# EAGLE design asserv-pami (EAGLE 9.6.2)
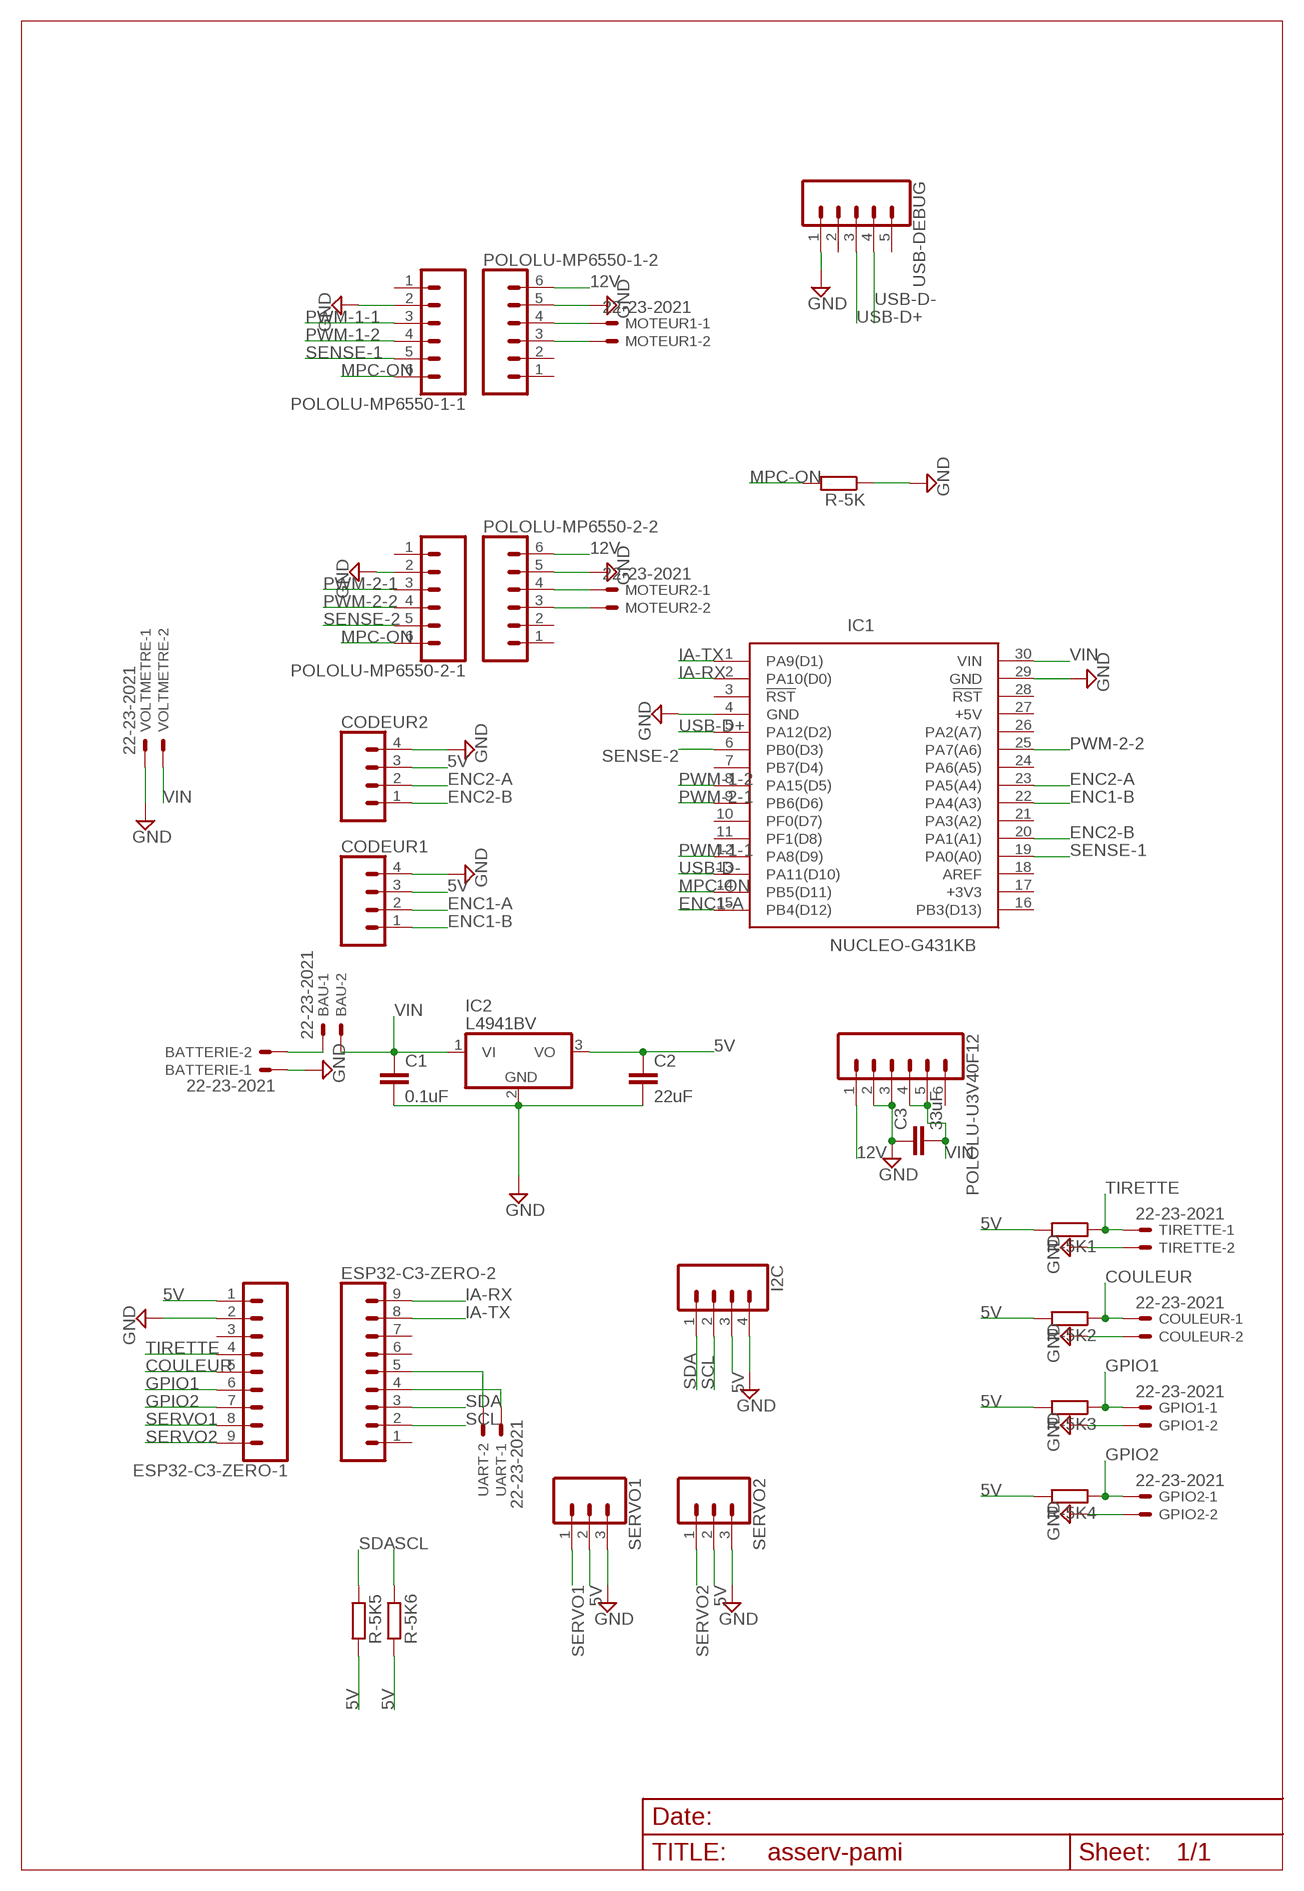
[diagram p0: schematic, sheet 1]

## Parts
BATTERIE  22-23-2021  [22-23-2021]
BAU  22-23-2021  [22-23-2021]
C1  0.1uF  C5/2.5  [C5B2.5]
C2  22uF  C5/2.5  [C5B2.5]
C3  33uF  C5/2.5  [C5B2.5]
CODEUR1  CONN_04PTH  [1X04]
CODEUR2  CONN_04PTH  [1X04]
COULEUR  22-23-2021  [22-23-2021]
ESP32-C3-ZERO-1  CONN_09LONGPADS  [1X09_LONGPADS]
ESP32-C3-ZERO-2  CONN_09LONGPADS  [1X09_LONGPADS]
GPIO1  22-23-2021  [22-23-2021]
GPIO2  22-23-2021  [22-23-2021]
I2C  CONN_04PTH  [1X04]
IC1  NUCLEO-G431KB  [DIPS1524W66P254L5029H1500Q30N]
IC2  L4941BV  7805TV  [TO220V]
MOTEUR1  22-23-2021  [22-23-2021]
MOTEUR2  22-23-2021  [22-23-2021]
POLOLU-MP6550-1-1  CONN_06NO_SILK_FEMALE_PTH  [1X06_NO_SILK]
POLOLU-MP6550-1-2  CONN_06NO_SILK_FEMALE_PTH  [1X06_NO_SILK]
POLOLU-MP6550-2-1  CONN_06NO_SILK_FEMALE_PTH  [1X06_NO_SILK]
POLOLU-MP6550-2-2  CONN_06NO_SILK_FEMALE_PTH  [1X06_NO_SILK]
POLOLU-U3V40F12  CONN_06NO_SILK_FEMALE_PTH  [1X06_NO_SILK]
R-5K  R-EU_0204/7  [0204/7]
R-5K1  R-EU_0204/7  [0204/7]
R-5K2  R-EU_0204/7  [0204/7]
R-5K3  R-EU_0204/7  [0204/7]
R-5K4  R-EU_0204/7  [0204/7]
R-5K5  R-EU_0204/7  [0204/7]
R-5K6  R-EU_0204/7  [0204/7]
SERVO1  CONN_03LONGPADS  [1X03_LONGPADS]
SERVO2  CONN_03LONGPADS  [1X03_LONGPADS]
TIRETTE  22-23-2021  [22-23-2021]
UART  22-23-2021  [22-23-2021]
USB-DEBUG  CONN_05NO_SILK  [1X05_NO_SILK]
VOLTMETRE  22-23-2021  [22-23-2021]

## Nets
5V: C2.1 CODEUR1.3 CODEUR2.3 ESP32-C3-ZERO-1.1 I2C.3 IC2.3(VO) R-5K1.2 R-5K2.2 R-5K3.2 R-5K4.2 R-5K5.2 R-5K6.2 SERVO1.2 SERVO2.2
12V: POLOLU-MP6550-1-2.6 POLOLU-MP6550-2-2.6 POLOLU-U3V40F12.1
COULEUR: COULEUR.1 ESP32-C3-ZERO-1.5 R-5K2.1
ENC1-A: CODEUR1.2 IC1.15(PB4(D12))
ENC1-B: CODEUR1.1 IC1.22(PA4(A3))
ENC2-A: CODEUR2.2 IC1.23(PA5(A4))
ENC2-B: CODEUR2.1 IC1.20(PA1(A1))
GND: BATTERIE.1 C1.2 C2.2 C3.1 CODEUR1.4 CODEUR2.4 COULEUR.2 ESP32-C3-ZERO-1.2 GPIO1.2 GPIO2.2 I2C.4 IC1.4(GND) IC1.29(GND) IC2.2(GND) POLOLU-MP6550-1-1.2 POLOLU-MP6550-1-2.5 POLOLU-MP6550-2-1.2 POLOLU-MP6550-2-2.5 POLOLU-U3V40F12.2 POLOLU-U3V40F12.3 R-5K.1 SERVO1.3 SERVO2.3 TIRETTE.2 USB-DEBUG.1 VOLTMETRE.1
GPIO1: ESP32-C3-ZERO-1.6 GPIO1.1 R-5K3.1
GPIO2: ESP32-C3-ZERO-1.7 GPIO2.1 R-5K4.1
IA-RX: ESP32-C3-ZERO-2.9 IC1.2(PA10(D0))
IA-TX: ESP32-C3-ZERO-2.8 IC1.1(PA9(D1))
MPC-ON: IC1.14(PB5(D11)) POLOLU-MP6550-1-1.6 POLOLU-MP6550-2-1.6 R-5K.2
N$1: MOTEUR1.1 POLOLU-MP6550-1-2.4
N$2: MOTEUR1.2 POLOLU-MP6550-1-2.3
N$3: MOTEUR2.1 POLOLU-MP6550-2-2.4
N$4: MOTEUR2.2 POLOLU-MP6550-2-2.3
N$5: ESP32-C3-ZERO-2.4 UART.1
N$6: ESP32-C3-ZERO-2.5 UART.2
N$7: BATTERIE.2 BAU.1
PWM-1-1: IC1.12(PA8(D9)) POLOLU-MP6550-1-1.3
PWM-1-2: IC1.8(PA15(D5)) POLOLU-MP6550-1-1.4
PWM-2-1: IC1.9(PB6(D6)) POLOLU-MP6550-2-1.3
PWM-2-2: IC1.25(PA7(A6)) POLOLU-MP6550-2-1.4
SCL: ESP32-C3-ZERO-2.2 I2C.2 R-5K6.1
SDA: ESP32-C3-ZERO-2.3 I2C.1 R-5K5.1
SENSE-1: IC1.19(PA0(A0)) POLOLU-MP6550-1-1.5
SENSE-2: IC1.6(PB0(D3)) POLOLU-MP6550-2-1.5
SERVO1: ESP32-C3-ZERO-1.8 SERVO1.1
SERVO2: ESP32-C3-ZERO-1.9 SERVO2.1
TIRETTE: ESP32-C3-ZERO-1.4 R-5K1.1 TIRETTE.1
USB-D+: IC1.5(PA12(D2)) USB-DEBUG.3
USB-D-: IC1.13(PA11(D10)) USB-DEBUG.4
VIN: BAU.2 C1.1 C3.2 IC1.30(VIN) IC2.1(VI) POLOLU-U3V40F12.4 POLOLU-U3V40F12.5 VOLTMETRE.2
Unconnected: ESP32-C3-ZERO-1.3 ESP32-C3-ZERO-2.1 ESP32-C3-ZERO-2.6 ESP32-C3-ZERO-2.7 IC1.3(!RST) IC1.7(PB7(D4)) IC1.10(PF0(D7)) IC1.11(PF1(D8)) IC1.16(PB3(D13)) IC1.17(+3V3) IC1.18(AREF) IC1.21(PA3(A2)) IC1.24(PA6(A5)) IC1.26(PA2(A7)) IC1.27(+5V) IC1.28(!RST) POLOLU-MP6550-1-1.1 POLOLU-MP6550-1-2.1 POLOLU-MP6550-1-2.2 POLOLU-MP6550-2-1.1 POLOLU-MP6550-2-2.1 POLOLU-MP6550-2-2.2 POLOLU-U3V40F12.6 USB-DEBUG.2 USB-DEBUG.5

## Library data of the parts
BATTERIE BAU COULEUR GPIO1 GPIO2 MOTEUR1 MOTEUR2 TIRETTE UART VOLTMETRE = con-molex:22-23-2021: .100" (2.54mm) Center Header - 2 Pin; MF: MOLEX; MPN: 22-23-2021; OC_FARNELL: 1462926; OC_NEWARK: 25C3832
C1-C3 = capacitor-wima:C: CAPACITOR naming: grid - package width
CODEUR1 CODEUR2 I2C = SparkFun-Connectors:CONN_04: Multi connection point. Often used as Generic Header-pin footprint for 0.1 inch spaced/style header connections On any of the 0.1 inch spaced packages, you can populate with these: Break Away Headers - Straight <https://www.sparkfun.com/products/116> (PRT-00116) Break Away Male Headers - Right Angle <https://www.sparkfun.com/products/553> (PRT-00553) Female Headers <https://www.sparkfun.com/products/115> (PRT-00115) Break Away Headers - Machine Pin <https://www.sparkfun.com/products/117> (PRT-00117) Break Away Female Headers - Swiss Machine Pin <https://www.sparkfun.com/products/743> (PRT-00743) For SCREWTERMINALS and SPRING TERMINALS visit here: Screw Terimnals on SparkFun.com <https://www.sparkfun.com/search/results?term=Screw+Terminals> (5mm/3.5mm/2.54mm spacing) This device is also useful as a general connection point to wire up your design to another part of your project. Our various solder wires solder well into these plated through hole pads. Hook-Up Wire - Assortment (Stranded, 22 AWG) <https://www.sparkfun.com/products/11375> (PRT-11375) Hook-Up Wire - Assortment (Solid Core, 22 AWG) <https://www.sparkfun.com/products/11367> (PRT-11367) View the entire wire category on our website here <https://www.sparkfun.com/categories/141> Special notes: Molex polarized connector foot print use with SKU : PRT-08231 with associated crimp pins and housings. 1MM SMD Version SKU: PRT-10208; PROD_ID: CONN-09696
ESP32-C3-ZERO-1 ESP32-C3-ZERO-2 = SparkFun-Connectors:CONN_09: Multi connection point. Often used as Generic Header-pin footprint for 0.1 inch spaced/style header connections On any of the 0.1 inch spaced packages, you can populate with these: Break Away Headers - Straight <https://www.sparkfun.com/products/116> (PRT-00116) Break Away Male Headers - Right Angle <https://www.sparkfun.com/products/553> (PRT-00553) Female Headers <https://www.sparkfun.com/products/115> (PRT-00115) Break Away Headers - Machine Pin <https://www.sparkfun.com/products/117> (PRT-00117) Break Away Female Headers - Swiss Machine Pin <https://www.sparkfun.com/products/743> (PRT-00743) For SCREWTERMINALS and SPRING TERMINALS visit here: Screw Terimnals on SparkFun.com <https://www.sparkfun.com/search/results?term=Screw+Terminals> (5mm/3.5mm/2.54mm spacing) This device is also useful as a general connection point to wire up your design to another part of your project. Our various solder wires solder well into these plated through hole pads. Hook-Up Wire - Assortment (Stranded, 22 AWG) <https://www.sparkfun.com/products/11375> (PRT-11375) Hook-Up Wire - Assortment (Solid Core, 22 AWG) <https://www.sparkfun.com/products/11367> (PRT-11367) View the entire wire category on our website here <https://www.sparkfun.com/categories/141> Special notes: Molex polarized connector foot print use with SKU : PRT-08231 with associated crimp pins and housings. 1MM SMD Version SKU: PRT-10208 NOTES ON THE VARIANTS LOCK and LOCK_LONGPADS... This footprint was designed to help hold the alignment of a through-hole component (i.e. 6-pin header) while soldering it into place. You may notice that each hole has been shifted either up or down by 0.005 of an inch from it's more standard position (which is a perfectly straight line). This slight alteration caused the pins (the squares in the middle) to touch the edges of the holes. Because they are alternating, it causes a "brace" to hold the component in place. 0.005 has proven to be the perfect amount of "off-center" position when using our standard breakaway headers. Although looks a little odd when you look at the bare footprint, once you have a header in there, the alteration is very hard to notice. Also,if you push a header all the way into place, it is covered up entirely on the bottom side.
IC1 = NUCLEO-G431KB:NUCLEO-G431KB: STM32 Nucleo-32 development board Source: Datasheet <http://www.st.com/content/ccc/resource/technical/document/data_brief/b1/d8/13/d4/b0/b7/4b/6e/DM00214578.pdf/files/DM00214578.pdf/jcr:content/translations/en.DM00214578.pdf>; ARROW_PART_NUMBER: NUCLEO-F303K8; ARROW_PRICE-STOCK: https://www.arrow.com/en/products/nucleo-f303k8/stmicroelectronics; DESCRIPTION: STM32 Nucleo-32 development board; HEIGHT: 15mm; MANUFACTURER_NAME: STMicroelectronics; MANUFACTURER_PART_NUMBER: NUCLEO-F303K8; RS_PART_NUMBER: 9092862; RS_PRICE-STOCK: http://uk.rs-online.com/web/p/products/9092862
IC2 = linear:78*: Positive VOLTAGE REGULATOR Source: http://cache.national.com/ds/LM/LM78L05.pdf http://www.fairchildsemi.com/ds/LM/LM7805.pdf
POLOLU-MP6550-1-1 POLOLU-MP6550-1-2 POLOLU-MP6550-2-1 POLOLU-MP6550-2-2 POLOLU-U3V40F12 = SparkFun-Connectors:CONN_06: Multi connection point. Often used as Generic Header-pin footprint for 0.1 inch spaced/style header connections On any of the 0.1 inch spaced packages, you can populate with these: Break Away Headers - Straight <https://www.sparkfun.com/products/116> (PRT-00116) Break Away Male Headers - Right Angle <https://www.sparkfun.com/products/553> (PRT-00553) Female Headers <https://www.sparkfun.com/products/115> (PRT-00115) Break Away Headers - Machine Pin <https://www.sparkfun.com/products/117> (PRT-00117) Break Away Female Headers - Swiss Machine Pin <https://www.sparkfun.com/products/743> (PRT-00743) Arduino Stackable Header - 6 Pin <https://www.sparkfun.com/products/9280> (PRT-09280) Screw Terminals 2.54mm Pitch (6-Pin) <https://www.sparkfun.com/products/16499> (PRT-16499) For SCREWTERMINALS and SPRING TERMINALS visit here: Screw Terimnals on SparkFun.com <https://www.sparkfun.com/search/results?term=Screw+Terminals> (5mm/3.5mm/2.54mm spacing) This device is also useful as a general connection point to wire up your design to another part of your project. Our various solder wires solder well into these plated through hole pads. Hook-Up Wire - Assortment (Stranded, 22 AWG) <https://www.sparkfun.com/products/11375> (PRT-11375) Hook-Up Wire - Assortment (Solid Core, 22 AWG) <https://www.sparkfun.com/products/11367> (PRT-11367) View the entire wire category on our website here <https://www.sparkfun.com/categories/141>; PROD_ID: CONN-08437
R-5K R-5K1-R-5K6 = rcl:R-EU_: RESISTOR, European symbol; SPICEPREFIX: R
SERVO1 SERVO2 = SparkFun-Connectors:CONN_03: Multi connection point. Often used as Generic Header-pin footprint for 0.1 inch spaced/style header connections On any of the 0.1 inch spaced packages, you can populate with these: Break Away Headers - Straight <https://www.sparkfun.com/products/116> (PRT-00116) Break Away Male Headers - Right Angle <https://www.sparkfun.com/products/553> (PRT-00553) Female Headers <https://www.sparkfun.com/products/115> (PRT-00115) Break Away Headers - Machine Pin <https://www.sparkfun.com/products/117> (PRT-00117) Break Away Female Headers - Swiss Machine Pin <https://www.sparkfun.com/products/743> (PRT-00743) Stackable Header - 3 Pin (Female, 0.1") <https://www.sparkfun.com/products/13875> (PRT-13875) For SCREWTERMINALS and SPRING TERMINALS visit here: Screw Terimnals on SparkFun.com <https://www.sparkfun.com/search/results?term=Screw+Terminals> (5mm/3.5mm/2.54mm spacing) This device is also useful as a general connection point to wire up your design to another part of your project. Our various solder wires solder well into these plated through hole pads. Hook-Up Wire - Assortment (Stranded, 22 AWG) <https://www.sparkfun.com/products/11375> (PRT-11375) Hook-Up Wire - Assortment (Solid Core, 22 AWG) <https://www.sparkfun.com/products/11367> (PRT-11367) View the entire wire category on our website here <https://www.sparkfun.com/categories/141> Special notes: Molex polarized connector foot print use with SKU : PRT-08232 with associated crimp pins and housings.
USB-DEBUG = SparkFun-Connectors:CONN_05: Multi connection point. Often used as Generic Header-pin footprint for 0.1 inch spaced/style header connections On any of the 0.1 inch spaced packages, you can populate with these: Break Away Headers - Straight <https://www.sparkfun.com/products/116> (PRT-00116) Break Away Male Headers - Right Angle <https://www.sparkfun.com/products/553> (PRT-00553) Female Headers <https://www.sparkfun.com/products/115> (PRT-00115) Break Away Headers - Machine Pin <https://www.sparkfun.com/products/117> (PRT-00117) Break Away Female Headers - Swiss Machine Pin <https://www.sparkfun.com/products/743> (PRT-00743) For SCREWTERMINALS and SPRING TERMINALS visit here: Screw Terimnals on SparkFun.com <https://www.sparkfun.com/search/results?term=Screw+Terminals> (5mm/3.5mm/2.54mm spacing) This device is also useful as a general connection point to wire up your design to another part of your project. Our various solder wires solder well into these plated through hole pads. Hook-Up Wire - Assortment (Stranded, 22 AWG) <https://www.sparkfun.com/products/11375> (PRT-11375) Hook-Up Wire - Assortment (Solid Core, 22 AWG) <https://www.sparkfun.com/products/11367> (PRT-11367) View the entire wire category on our website here <https://www.sparkfun.com/categories/141> Special notes: Molex polarized connector foot print use with SKU : PRT-08231 with associated crimp pins and housings. 1MM SMD Version SKU: PRT-10208

## Board
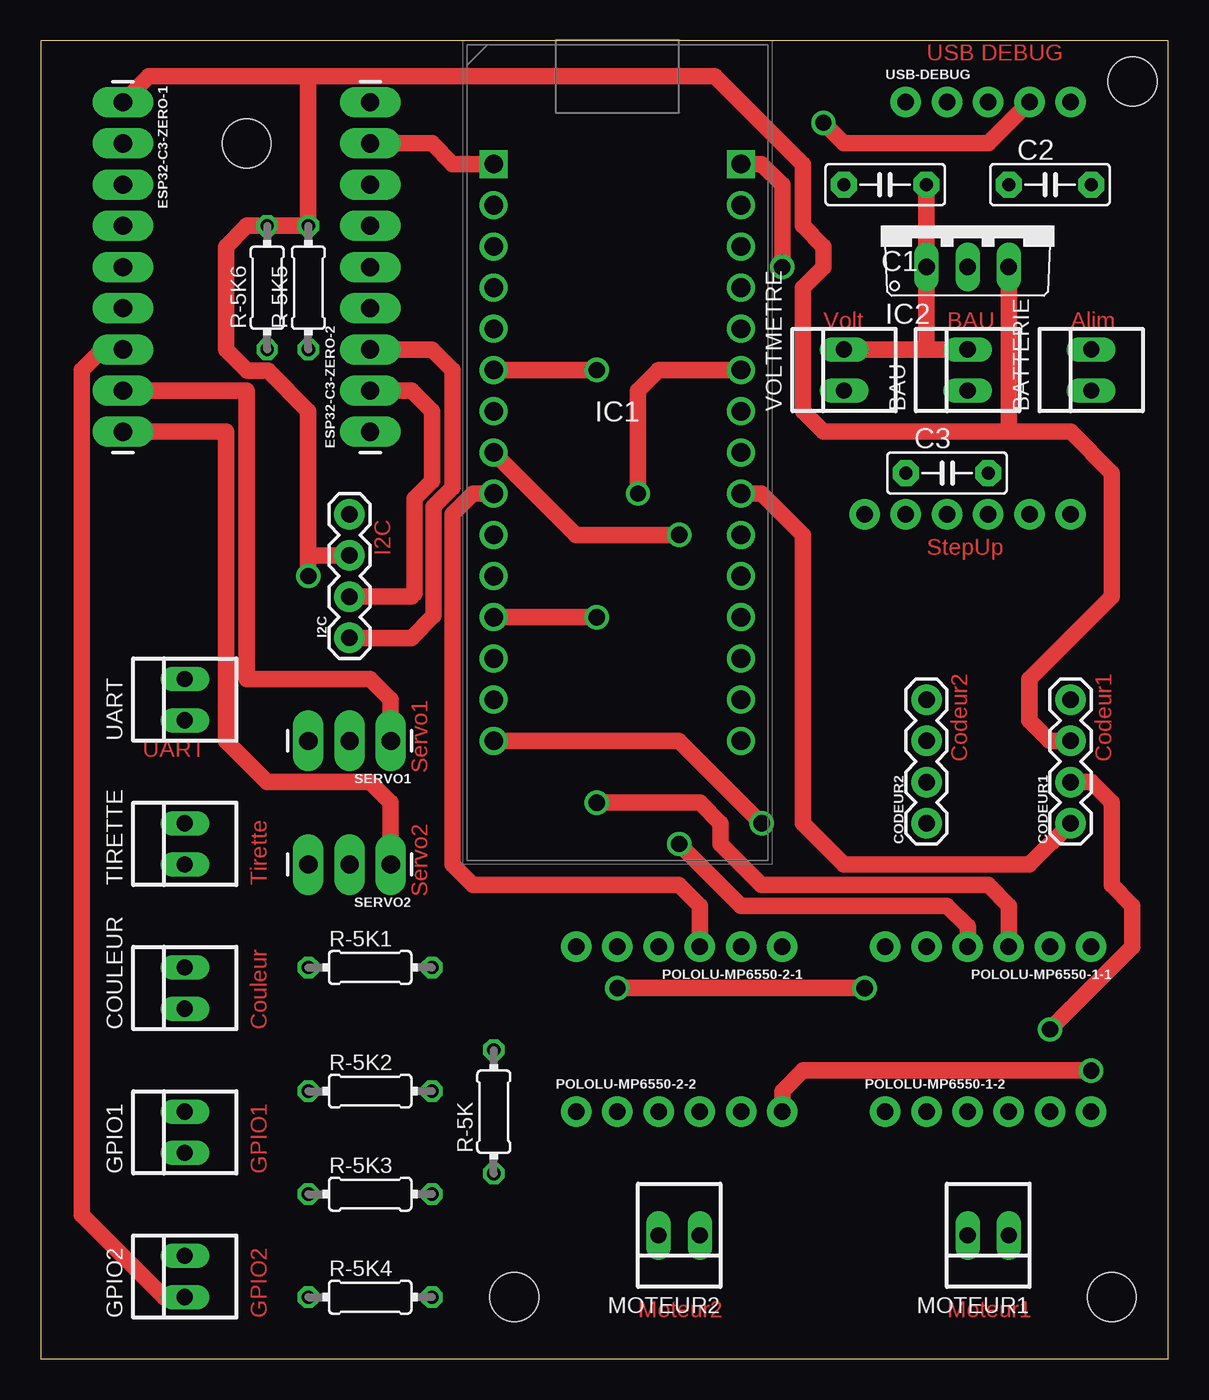
[diagram p1: board, top side]
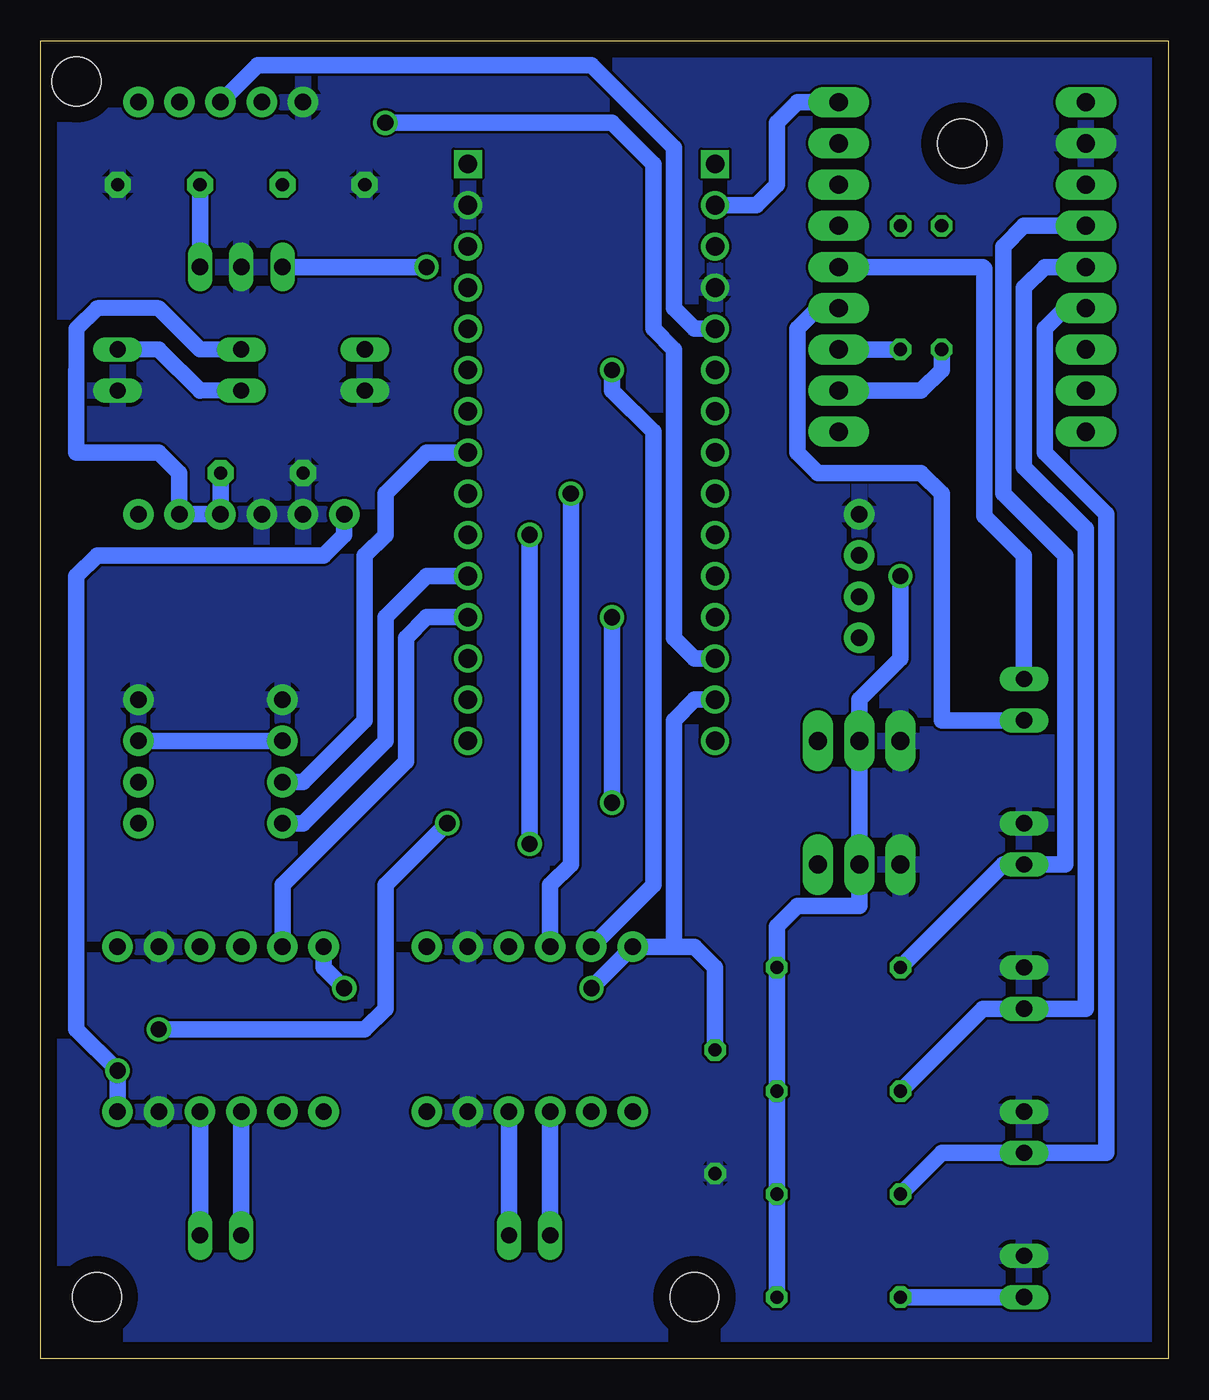
[diagram p2: board, bottom side, seen from below]

Size 69.52 x 81.27 mm. Coordinates in mm from the lower left corner, seen from the top.
Outline: 0,0 69.52,0 69.52,81.27 0,81.27 0,0
Copper layers (1*16): Top 0.035mm / dielectric 1.5mm / Bottom 0.035mm
Design rules "default": minimum track width 6mil, minimum drill 0.35mm, track to track 6mil, track to pad 6mil, pad to pad 6mil, via to via 6mil, smd to smd 6mil, copper to edge 40mil, drill to drill 6mil, minimum pad ring 10mil, minimum via ring 8mil, stop-mask expansion 4mil, vias tented up to drill 0mil, thermal gap 10mil
Holes 3 mm at 66.04,3.81 67.31,78.74 29.21,3.81 12.7,74.93

### Footprints (pad centres in the part's own frame; a part is rotated, then mirrored left to right if it is on the bottom)
22-23-2021 = drill 1 long: 1 -1.27,0; 2 1.27,0
C5B2.5 = drill 0.813 pad 1.6 octagon: 1 -2.54,0; 2 2.54,0
1X04 = drill 1.016 pad 1.88: 1 0,0; 2 2.54,0; 3 5.08,0; 4 7.62,0
1X09_LONGPADS = drill 1.118 pad 1.88 long: 1 0,0; 2 2.54,0; 3 5.08,0; 4 7.62,0; 5 10.16,0; 6 12.7,0; 7 15.24,0; 8 17.78,0; 9 20.32,0
DIPS1524W66P254L5029H1500Q30N = drill 1.15 pad 1.725 square: 1 -7.62,17.78; 30 7.62,17.78 | drill 1.15 pad 1.725: 2 -7.62,15.24; 3 -7.62,12.7; 4 -7.62,10.16; 5 -7.62,7.62; 6 -7.62,5.08; 7 -7.62,2.54; 8 -7.62,0; 9 -7.62,-2.54; 10 -7.62,-5.08; 11 -7.62,-7.62; 12 -7.62,-10.16; 13 -7.62,-12.7; 14 -7.62,-15.24; 15 -7.62,-17.78; 16 7.62,-17.78; 17 7.62,-15.24; 18 7.62,-12.7; 19 7.62,-10.16; 20 7.62,-7.62; 21 7.62,-5.08; 22 7.62,-2.54; 23 7.62,0; 24 7.62,2.54; 25 7.62,5.08; 26 7.62,7.62; 27 7.62,10.16; 28 7.62,12.7; 29 7.62,15.24
TO220V = drill 1.016 long: 1 -2.54,-2.54; 2 0,-2.54; 3 2.54,-2.54
1X06_NO_SILK = drill 1.016 pad 1.88: 1 0,0; 2 2.54,0; 3 5.08,0; 4 7.62,0; 5 10.16,0; 6 12.7,0
0204/7 = drill 0.813 octagon: 1 -3.81,0; 2 3.81,0
1X03_LONGPADS = drill 1.118 pad 1.88 long: 1 0,0; 2 2.54,0; 3 5.08,0
1X05_NO_SILK = drill 1.016 pad 1.88: 1 0,0; 2 2.54,0; 3 5.08,0; 4 7.62,0; 5 10.16,0

### Placement (x,y rotation side)
BATTERIE  64.77,60.96 90 top
BAU  57.15,60.96 90 top
C1  52.07,72.39 180 top
C2  62.23,72.39 0 top
C3  55.88,54.61 0 top
CODEUR1  63.5,33.02 90 top
CODEUR2  54.61,33.02 90 top
COULEUR  8.89,22.86 90 top
ESP32-C3-ZERO-1  5.08,77.47 270 top
ESP32-C3-ZERO-2  20.32,57.15 90 top
GPIO1  8.89,13.97 90 top
GPIO2  8.89,5.08 90 top
I2C  19.05,44.45 90 top
IC1  35.56,55.88 0 top
IC2  57.15,69.85 0 top
MOTEUR1  58.42,7.62 180 top
MOTEUR2  39.37,7.62 180 top
POLOLU-MP6550-1-1  64.77,25.4 180 top
POLOLU-MP6550-1-2  52.07,15.24 0 top
POLOLU-MP6550-2-1  45.72,25.4 180 top
POLOLU-MP6550-2-2  33.02,15.24 0 top
POLOLU-U3V40F12  50.8,52.07 0 top
R-5K  27.94,15.24 90 top
R-5K1  20.32,24.13 0 top
R-5K2  20.32,16.51 0 top
R-5K3  20.32,10.16 0 top
R-5K4  20.32,3.81 0 top
R-5K5  16.51,66.04 90 top
R-5K6  13.97,66.04 90 top
SERVO1  21.59,38.1 180 top
SERVO2  21.59,30.48 180 top
TIRETTE  8.89,31.75 90 top
UART  8.89,40.64 90 top
USB-DEBUG  53.34,77.47 0 top
VOLTMETRE  49.53,60.96 90 top

### Tracks (layer width: path | path; a pad name or v marks a point on that pad's centre or on a via)
5V  (via drill 1)
  Top 1.016: ESP32-C3-ZERO-1.1 6.68,79.07 16.51,79.07 | v16.51,48.26 16.51,49.53 | I2C.3 16.51,49.53 | 16.51,79.07 R-5K5.2 R-5K6.2 12.7,69.85 11.43,68.58 11.43,62.23 12.75,60.91 14.02,60.91 16.51,58.42 16.51,49.53 | 16.51,79.07 41.58,79.07 46.99,73.66 46.99,69.85 48.26,68.58 48.26,67.31 46.99,66.04 46.99,58.42 48.26,57.15 59.69,57.15 | CODEUR1.3 62.23,38.1 60.96,39.37 60.96,41.91 66.04,46.99 66.04,54.61 63.5,57.15 59.69,57.15 | IC2.3 59.69,57.15
  Bottom 1.016: C2.1 IC2.3 | R-5K4.2 R-5K3.2 R-5K2.2 R-5K1.2 24.13,26.67 22.86,27.94 19.05,27.94 SERVO2.2 SERVO1.2 19.05,40.64 16.51,43.18 v16.51,48.26 | CODEUR2.3 CODEUR1.3
12V  (via drill 1)
  Top 1.016: POLOLU-MP6550-2-2.6 45.72,16.51 46.99,17.78 v64.77,17.78
  Bottom 1.016: POLOLU-MP6550-1-2.6 v64.77,17.78 67.31,20.32 67.31,48.26 66.04,49.53 52.07,49.53 50.8,50.8 POLOLU-U3V40F12.1
COULEUR
  Bottom 1.016: R-5K2.1 11.43,21.59 COULEUR.1 5.08,21.59 5.08,51.18 8.89,54.99 8.89,66.04 7.62,67.31 ESP32-C3-ZERO-1.5
ENC1-A  (via drill 1)
  Top 1.016: IC1.15 39.37,38.1 v44.45,33.02 | v62.23,20.32 67.31,25.4 67.31,27.94 66.04,29.21 66.04,34.29 64.77,35.56 CODEUR1.2
  Bottom 1.016: v44.45,33.02 48.26,29.21 48.26,21.59 49.53,20.32 v62.23,20.32
ENC1-B
  Top 1.016: CODEUR1.1 60.96,30.48 49.53,30.48 46.99,33.02 46.99,50.8 44.45,53.34 IC1.22
ENC2-A
  Bottom 1.016: CODEUR2.2 53.34,35.56 49.53,39.37 49.53,49.53 48.26,50.8 48.26,53.34 45.72,55.88 IC1.23
ENC2-B
  Bottom 1.016: CODEUR2.1 53.34,33.02 48.26,38.1 48.26,45.72 45.72,48.26 IC1.20
GND
  pour Bottom: 0,81.28 69.85,81.28 69.85,0 0,0
GPIO1
  Bottom 1.016: R-5K3.1 13.97,12.7 GPIO1.1 3.81,12.7 3.81,52.07 7.62,55.88 7.62,63.5 6.35,64.77 ESP32-C3-ZERO-1.6
GPIO2
  Top 1.016: GPIO2.1 7.62,3.81 2.54,8.89 2.54,60.96 3.81,62.23 ESP32-C3-ZERO-1.7
  Bottom 1.016: R-5K4.1 GPIO2.1
IA-RX
  Bottom 1.016: ESP32-C3-ZERO-2.9 22.86,77.47 24.13,76.2 24.13,72.39 25.4,71.12 IC1.2
IA-TX
  Top 1.016: ESP32-C3-ZERO-2.8 24.13,74.93 25.4,73.66 IC1.1
MPC-ON  (via drill 1)
  Top 1.016: v35.56,22.86 v50.8,22.86
  Bottom 1.016: R-5K.2 27.94,24.13 29.21,25.4 30.48,25.4 | 30.48,25.4 POLOLU-MP6550-2-1.6 v35.56,22.86 | POLOLU-MP6550-1-1.6 52.07,24.13 v50.8,22.86 | IC1.14 29.21,40.64 30.48,39.37 30.48,25.4
N$1
  Bottom 1.016: POLOLU-MP6550-1-2.4 MOTEUR1.1
N$2
  Bottom 1.016: POLOLU-MP6550-1-2.3 MOTEUR1.2
N$3
  Bottom 1.016: POLOLU-MP6550-2-2.4 MOTEUR2.1
N$4
  Bottom 1.016: POLOLU-MP6550-2-2.3 MOTEUR2.2
N$5
  Bottom 1.016: ESP32-C3-ZERO-2.4 21.59,64.77 22.86,63.5 22.86,55.88 21.59,54.61 15.24,54.61 13.97,53.34 13.97,39.37 UART.1
N$6
  Bottom 1.016: ESP32-C3-ZERO-2.5 11.43,67.31 11.33,67.21 11.33,51.97 8.89,49.53 UART.2
N$7
  Bottom 1: BAU.1 59.69,59.69 62.23,62.23 BATTERIE.2
PWM-1-1  (via drill 1)
  Top 1.016: v34.29,45.72 IC1.12 | POLOLU-MP6550-1-1.3 59.69,27.94 58.42,29.21 44.45,29.21 41.91,31.75 41.91,33.02 40.64,34.29 v34.29,34.29
  Bottom 1.016: v34.29,34.29 v34.29,45.72
PWM-1-2  (via drill 1)
  Top 1.016: v39.37,50.8 33.02,50.8 IC1.8 | POLOLU-MP6550-1-1.4 57.15,26.67 55.88,27.94 43.18,27.94 v39.37,31.75
  Bottom 1.016: v39.37,31.75 v39.37,50.8
PWM-2-1
  Top 1.016: POLOLU-MP6550-2-1.3 40.64,27.94 39.37,29.21 26.67,29.21 25.4,30.48 25.4,52.07 26.67,53.34 IC1.9
PWM-2-2  (via drill 1)
  Top 1.016: v36.83,53.34 36.83,59.69 38.1,60.96 IC1.25
  Bottom 1.016: POLOLU-MP6550-2-1.4 38.1,29.21 36.83,30.48 v36.83,53.34
SCL
  Top 1.016: I2C.2 22.86,46.99 23.06,47.19 23.06,53.04 24.13,54.1 24.13,58.42 22.86,59.69 ESP32-C3-ZERO-2.2
  Bottom 1.016: ESP32-C3-ZERO-2.2 15.24,59.69 13.97,60.96 R-5K6.1
SDA
  Top 1.016: I2C.1 22.86,44.45 24.23,45.82 24.23,52.55 25.4,53.72 25.4,60.96 24.13,62.23 ESP32-C3-ZERO-2.3
  Bottom 1.016: ESP32-C3-ZERO-2.3 R-5K5.1
SENSE-1
  Bottom 1.016: IC1.19 45.72,45.72 46.99,44.45 46.99,36.83 54.61,29.21 POLOLU-MP6550-1-1.5
SENSE-2  (via drill 1)
  Top 1.016: v34.29,60.96 IC1.6
  Bottom 1.016: POLOLU-MP6550-2-1.5 31.75,29.21 31.75,57.15 34.29,59.69 v34.29,60.96
SERVO1
  Top 1.016: SERVO1.1 21.59,40.64 20.32,41.91 12.7,41.91 12.7,59.69 ESP32-C3-ZERO-1.8
SERVO2
  Top 1.016: SERVO2.1 21.59,34.29 20.32,35.56 13.97,35.56 11.43,38.1 11.43,57.15 ESP32-C3-ZERO-1.9
TIRETTE
  Bottom 1.016: R-5K1.1 10.16,30.48 TIRETTE.1 6.35,30.48 6.35,49.53 10.16,53.34 10.16,68.58 8.89,69.85 ESP32-C3-ZERO-1.4
USB-D+
  Bottom 1.016: USB-DEBUG.3 56.14,79.75 35.56,79.75 30.48,74.67 30.48,64.77 29.21,63.5 IC1.5
USB-D-  (via drill 1)
  Top 1.016: USB-DEBUG.4 58.42,74.93 49.53,74.93 v48.26,76.2
  Bottom 1.016: v48.26,76.2 34.29,76.2 31.75,73.66 31.75,63.5 30.48,62.23 30.48,44.45 29.21,43.18 IC1.13
VIN  (via drill 1)
  Top 1.016: C1.1 IC2.1 54.61,62.23 | VOLTMETRE.2 54.61,62.23 | 54.61,62.23 BAU.2 | IC1.30 44.45,73.66 45.72,72.39 v45.72,67.31
  Bottom 1: BAU.2 59.69,62.23 62.23,64.77 66.04,64.77 67.31,63.5 67.31,60.96
  Bottom 1.016: 67.31,60.96 67.31,55.88 62.23,55.88 60.96,54.61 POLOLU-U3V40F12.5 POLOLU-U3V40F12.4 C3.2 | IC2.1 v45.72,67.31

### Text on the board
Top: USB DEBUG | Volt | BAU | Alim | I2C | StepUp | Servo1 | UART | Codeur2 | Codeur1 | Servo2 | Tirette | Couleur | GPIO1 | GPIO2 | Moteur2 | Moteur1